# EAGLE design CANBridge (EAGLE 9.6.2)
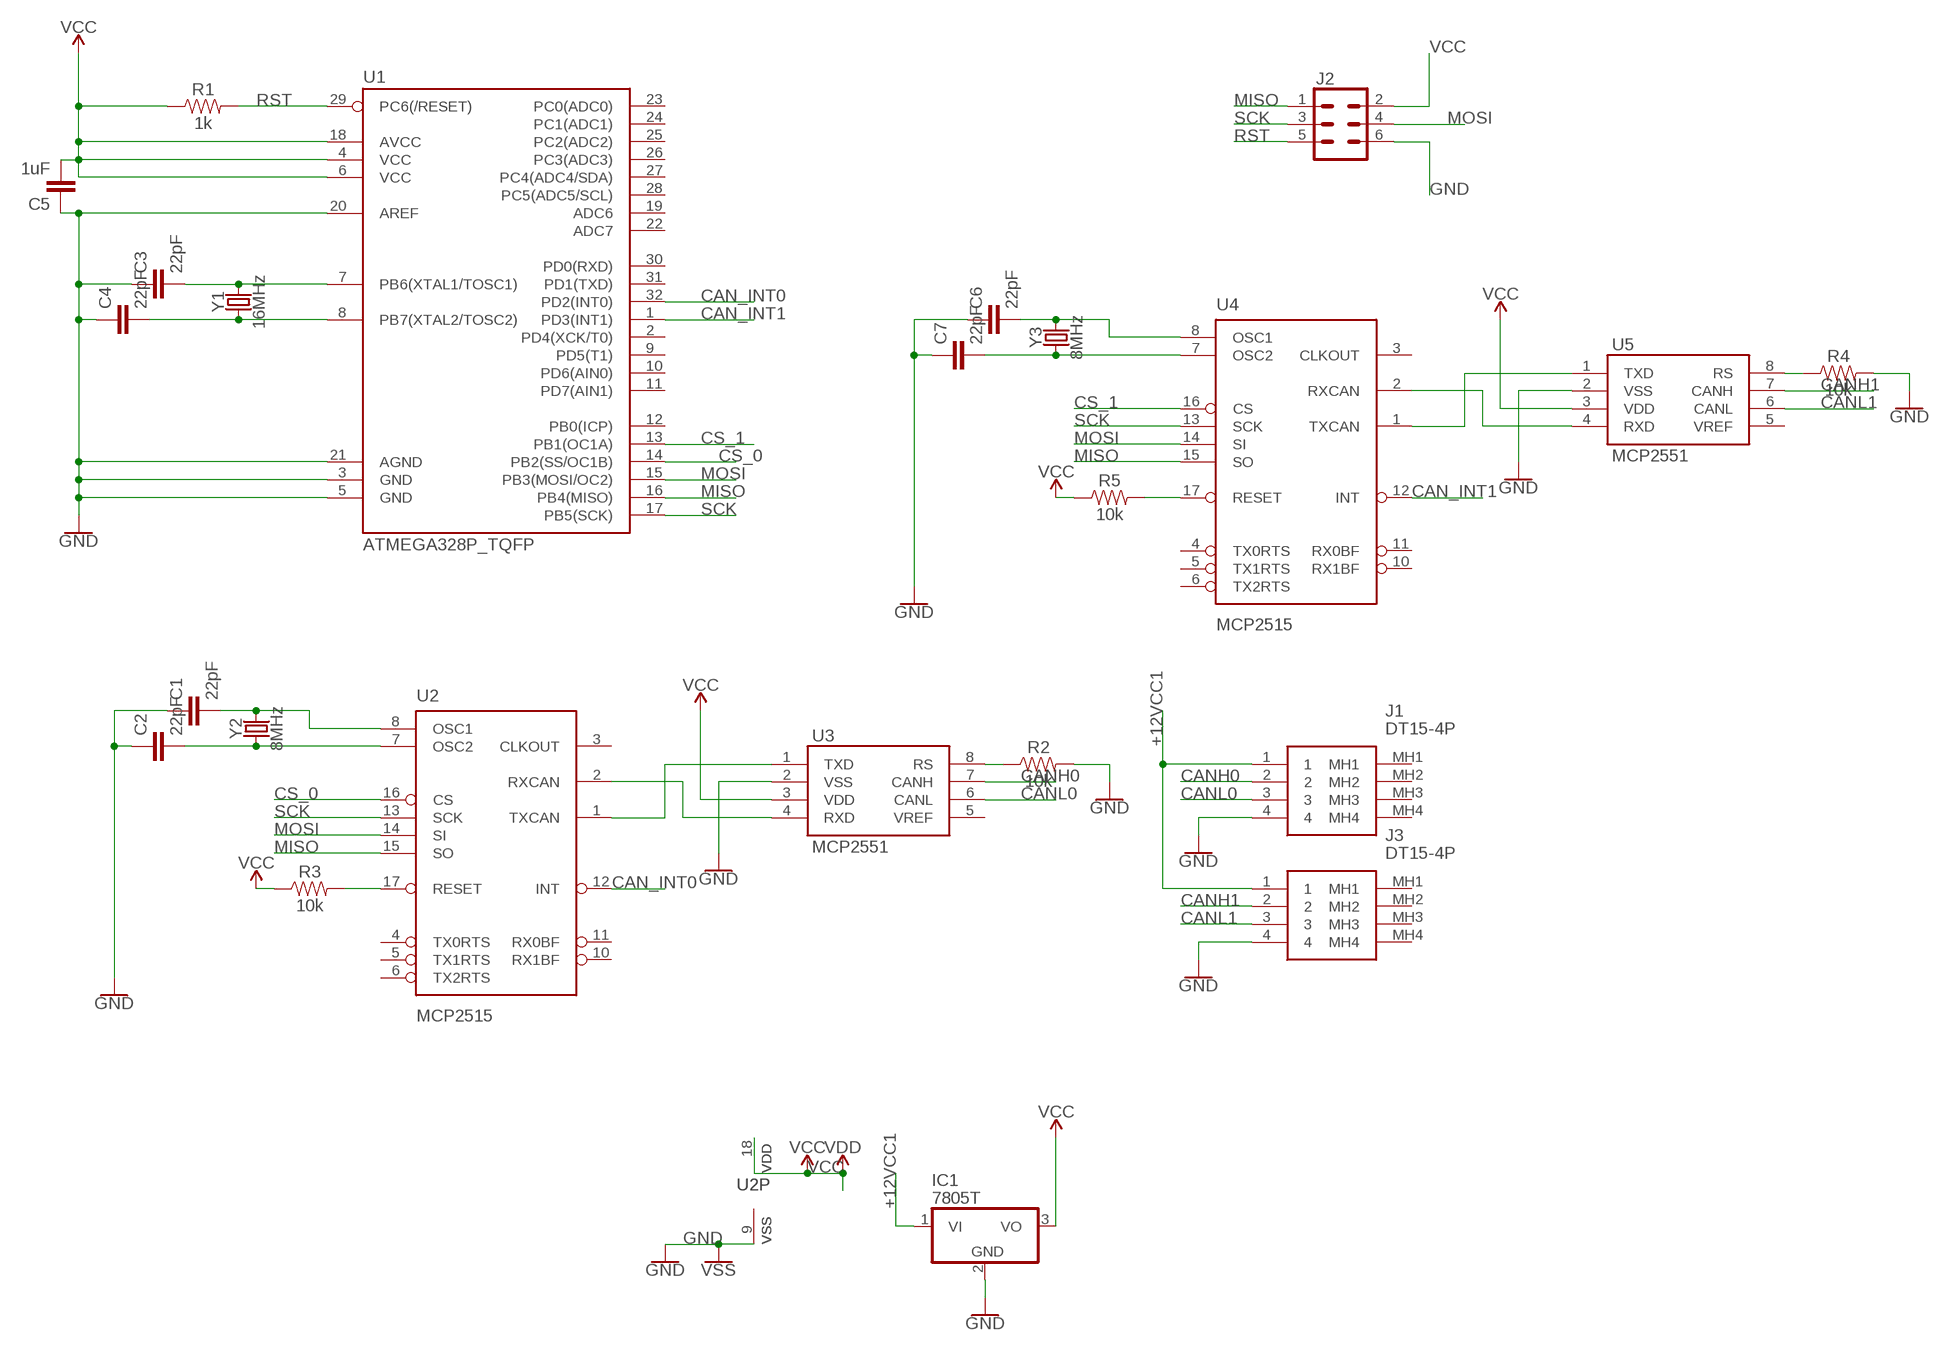
[diagram p0: schematic, sheet 1]

## Parts
C1  22pF  22PF-0603-50V-5%  [0603]
C2  22pF  22PF-0603-50V-5%  [0603]
C3  22pF  22PF-0603-50V-5%  [0603]
C4  22pF  22PF-0603-50V-5%  [0603]
C5  1uF  22PF-0603-50V-5%  [0603]
C6  22pF  22PF-0603-50V-5%  [0603]
C7  22pF  22PF-0603-50V-5%  [0603]
IC1  7805T  [TO220H]
J1  DT15-4P  [DT154P]
J2  CONN_03X2SHROUD  [2X3-SHROUDED]
J3  DT15-4P  [DT154P]
R1  1k  1KOHM-0603-1/10W-1%  [0603]
R2  10k  1KOHM-0603-1/10W-1%  [0603]
R3  10k  1KOHM-0603-1/10W-1%  [0603]
R4  10k  1KOHM-0603-1/10W-1%  [0603]
R5  10k  1KOHM-0603-1/10W-1%  [0603]
U1  ATMEGA328P_TQFP  [TQFP32-08]
U2  MCP2515  MCP2515(MCP2510)SO  [SO18W]
U3  MCP2551  [SO08]
U4  MCP2515  MCP2515(MCP2510)SO  [SO18W]
U5  MCP2551  [SO08]
Y1  16MHz  CRYSTAL-8MHZSMD-HC49UP  [HC49UP]
Y2  8MHz  CRYSTAL-8MHZSMD-HC49UP  [HC49UP]
Y3  8MHz  CRYSTAL-8MHZSMD-HC49UP  [HC49UP]

## Nets
+12VCC1: IC1.1(VI) J1.1 J3.1
CAN_INT0: U1.32(PD2(INT0)) U2.12(INT)
CAN_INT1: U1.1(PD3(INT1)) U4.12(INT)
CANH0: J1.2 U3.7(CANH)
CANH1: J3.2 U5.7(CANH)
CANL0: J1.3 U3.6(CANL)
CANL1: J3.3 U5.6(CANL)
CS_0: U1.14(PB2(SS/OC1B)) U2.16(CS)
CS_1: U1.13(PB1(OC1A)) U4.16(CS)
GND: C1.1 C2.1 C3.1 C4.1 C5.1 C6.1 C7.1 IC1.2(GND) J1.4 J2.6 J3.4 R2.2 R4.2 U1.3(GND) U1.5(GND) U1.20(AREF) U1.21(AGND) U2.9(VSS) U3.2(VSS) U5.2(VSS) ; supply symbol labelled VSS
MISO: J2.1 U1.16(PB4(MISO)) U2.15(SO) U4.15(SO)
MOSI: J2.4 U1.15(PB3(MOSI/OC2)) U2.14(SI) U4.14(SI)
N$1: U2.1(TXCAN) U3.1(TXD)
N$2: U2.2(RXCAN) U3.4(RXD)
N$3: C2.2 U2.7(OSC2) Y2.1
N$4: C1.2 U2.8(OSC1) Y2.2
N$5: C4.2 U1.8(PB7(XTAL2/TOSC2)) Y1.1
N$6: C3.2 U1.7(PB6(XTAL1/TOSC1)) Y1.2
N$7: R2.1 U3.8(RS)
N$8: R3.2 U2.17(RESET)
N$9: U4.1(TXCAN) U5.1(TXD)
N$10: U4.2(RXCAN) U5.4(RXD)
N$11: C7.2 U4.7(OSC2) Y3.1
N$12: C6.2 U4.8(OSC1) Y3.2
N$13: R4.1 U5.8(RS)
N$14: R5.2 U4.17(RESET)
RST: J2.5 R1.2 U1.29(PC6(/RESET))
SCK: J2.3 U1.17(PB5(SCK)) U2.13(SCK) U4.13(SCK)
VCC: C5.2 IC1.3(VO) J2.2 R1.1 R3.1 R5.1 U1.4(VCC) U1.6(VCC) U1.18(AVCC) U2.18(VDD) U3.3(VDD) U5.3(VDD) ; supply symbol labelled VDD
Unconnected: J1.MH1 J1.MH2 J1.MH3 J1.MH4 J3.MH1 J3.MH2 J3.MH3 J3.MH4 U1.2(PD4(XCK/T0)) U1.9(PD5(T1)) U1.10(PD6(AIN0)) U1.11(PD7(AIN1)) U1.12(PB0(ICP)) U1.19(ADC6) U1.22(ADC7) U1.23(PC0(ADC0)) U1.24(PC1(ADC1)) U1.25(PC2(ADC2)) U1.26(PC3(ADC3)) U1.27(PC4(ADC4/SDA)) U1.28(PC5(ADC5/SCL)) U1.30(PD0(RXD)) U1.31(PD1(TXD)) U2.3(CLKOUT) U2.4(TX0RTS) U2.5(TX1RTS) U2.6(TX2RTS) U2.10(RX1BF) U2.11(RX0BF) U3.5(VREF) U4.3(CLKOUT) U4.4(TX0RTS) U4.5(TX1RTS) U4.6(TX2RTS) U4.10(RX1BF) U4.11(RX0BF) U5.5(VREF)

## Power pins joined to a net without a drawn wire
VDD: U4.18(VDD)
VSS: U4.9(VSS)

## Library data of the parts
C1-C4 C6 C7 = SparkFun-Capacitors:22PF: 22pF ceramic capacitors A capacitor is a passive two-terminal electrical component used to store electrical energy temporarily in an electric field.; PROD_ID: CAP-07876
C5 = SparkFun-Capacitors:22PF: 22pF ceramic capacitors A capacitor is a passive two-terminal electrical component used to store electrical energy temporarily in an electric field.; PROD_ID: CAP-07876; VALUE: 22pF
IC1 = linear:78*: Positive VOLTAGE REGULATOR Source: http://cache.national.com/ds/LM/LM78L05.pdf http://www.fairchildsemi.com/ds/LM/LM7805.pdf
J1 J3 = DT15-4P:DT15-4P: Deutsch DT15 Series, 4.44mm Pitch 4 Way 2 Row Straight PCB Header, Solder Termination Source: Datasheet <https://www.te.com/commerce/DocumentDelivery/DDEController?Action=showdoc&DocId=Customer DrawingDT15-4PD2pdfEnglishENG_CD_DT15-4P_D2.pdfDT15-4P>; DESCRIPTION: Deutsch DT15 Series, 4.44mm Pitch 4 Way 2 Row Straight PCB Header, Solder Termination; HEIGHT: 30.35mm; MANUFACTURER_NAME: TE Connectivity; MANUFACTURER_PART_NUMBER: DT15-4P; MOUSER_PART_NUMBER: 571-DT15-4P; MOUSER_PRICE-STOCK: https://www.mouser.co.uk/ProductDetail/TE-Connectivity-DEUTSCH/DT15-4P?qs=vkMqrgFpRajtjo1r4fVe%2Fw%3D%3D
J2 = SparkFun-Connectors:CONN_03X2: Multi connection point. Often used as Generic Header-pin footprint for 0.1 inch spaced/style header connections You can populate with any combo of single row headers, but if you'd like an exact match, check these: Header - 2x3 (Male, 0.1") <https://www.sparkfun.com/products/12807> (PRT-12807) Header - 2x3 (Female, 0.1") <https://www.sparkfun.com/products/13010> (PRT-13010) 2x3 Pin Shrouded Header <https://www.sparkfun.com/products/10877> (PRT-10877) On any of the 0.1 inch spaced packages, you can populate with these: Break Away Headers - Straight <https://www.sparkfun.com/products/116> (PRT-00116) Break Away Male Headers - Right Angle <https://www.sparkfun.com/products/553> (PRT-00553) Female Headers <https://www.sparkfun.com/products/115> (PRT-00115) Break Away Headers - Machine Pin <https://www.sparkfun.com/products/117> (PRT-00117) Break Away Female Headers - Swiss Machine Pin <https://www.sparkfun.com/products/743> (PRT-00743) Special note: the shrouded connector mates well with our 3x2 ribbon cables: Ribbon Crimp Connector - 6-pin (2x3, Female) <https://www.sparkfun.com/products/10651> (PRT-10651) Ribbon Cable - 6 wire (15ft) <https://www.sparkfun.com/products/10646> (PRT-10646); PROD_ID: CONN-10681; SF_ID: PRT_10877
R1 = SparkFun-Resistors:1KOHM: 1kΩ resistor A resistor is a passive two-terminal electrical component that implements electrical resistance as a circuit element. Resistors act to reduce current flow, and, at the same time, act to lower voltage levels within circuits. - Wikipedia; PROD_ID: RES-07856
R2-R5 = SparkFun-Resistors:1KOHM: 1kΩ resistor A resistor is a passive two-terminal electrical component that implements electrical resistance as a circuit element. Resistors act to reduce current flow, and, at the same time, act to lower voltage levels within circuits. - Wikipedia; PROD_ID: RES-07856; VALUE: 1k
U1 = SparkFun-IC-Microcontroller:ATMEGA328P_TQFP: Popular 328P in QFP Storefront component: ATmega328 - TQFP <https://www.sparkfun.com/products/13448> (COM-13448) Datasheet <http://www.sparkfun.com/datasheets/Components/SMD/ATMega328.pdf> SparkFun Products SparkFun RedBoard - Programmed with Arduino <https://www.sparkfun.com/products/12757> (DEV-12757) Arduino Pro Mini 328 - 5V/16MHz <https://www.sparkfun.com/products/11113> (DEV-11113) Arduino Pro Mini 328 - 3.3V/8MHz <https://www.sparkfun.com/products/11114> (DEV-11114) SparkFun OpenLog <https://www.sparkfun.com/products/13712> (DEV-13712) SparkFun MicroView - OLED Arduino Module <https://www.sparkfun.com/products/12923> (DEV-12923) SparkFun Digital Sandbox <https://www.sparkfun.com/products/12651> (DEV-12651) SparkFun PicoBoard <https://www.sparkfun.com/products/11888> (WIG-11888) Arduino Fio <https://www.sparkfun.com/products/10116> (DEV-10116) LilyPad Arduino 328 Main Board <https://www.sparkfun.com/products/13342> (DEV-13342) SparkFun RedStick <https://www.sparkfun.com/products/13741> (DEV-13741) LilyPad MP3 <https://www.sparkfun.com/products/11013> (DEV-11013) LilyPad Arduino SimpleSnap <https://www.sparkfun.com/products/10941> (DEV-10941) SparkFun Stepoko <https://www.sparkfun.com/products/13899> (ROB-13899) SparkFun Geiger Counter <https://www.sparkfun.com/products/11345> (SEN-11345) SparkFun EL Sequencer <https://www.sparkfun.com/products/12781> (COM-12781) Arduino Pro 328 - 5V/16MHz <https://www.sparkfun.com/products/10915> (DEV-10915) CryptoCape <https://www.sparkfun.com/products/12773> (DEV-12773) SparkFun IR Thermometer Evaluation Board - MLX90614 <https://www.sparkfun.com/products/10740> (SEN-10740) SparkFun RedBot Mainboard <https://www.sparkfun.com/products/12097> (ROB-12097) Arduino Pro 328 - 3.3V/8MHz <https://www.sparkfun.com/products/10914> (DEV-10914) SparkFun Block for Intel® Edison - Arduino <https://www.sparkfun.com/products/13036> (DEV-13036) SparkFun Simon Says - Surface Mount Soldering Kit <https://www.sparkfun.com/products/10935> (KIT-10935) SparkFun 7-Segment Serial Display - Red <https://www.sparkfun.com/products/11441> (COM-11441) SparkFun 7-Segment Serial Display - White <https://www.sparkfun.com/products/11629> (COM-11629) SparkFun 7-Segment Serial Display - Yellow <https://www.sparkfun.com/products/11443> (COM-11443) SparkFun 7-Segment Serial Display - Kelly Green <https://www.sparkfun.com/products/11440> (COM-11440) SparkFun 7-Segment Serial Display - Blue <https://www.sparkfun.com/products/11442> (COM-11442) SparkFun OpenSegment Serial Display - 20mm (Blue) <https://www.sparkfun.com/products/11647> (COM-11647) SparkFun OpenSegment Serial Display - 20mm (Green) <https://www.sparkfun.com/products/11646> (COM-11646) SparkFun OpenSegment Serial Display - 20mm (White) <https://www.sparkfun.com/products/11648> (COM-11648) SparkFun OpenSegment Serial Display - 20mm (Red) <https://www.sparkfun.com/products/11644> (COM-11644) SparkFun OpenSegment Serial Display - 20mm (Yellow) <https://www.sparkfun.com/products/11645> (COM-11645) SparkFun OpenSegment Shield <https://www.sparkfun.com/products/13190> (DEV-13190); PROD_ID: IC-09069
U2 U4 = SparkFun-IC-Comms:MCP2515(MCP2510): CAN controller with SPI interface The MCP2515 controller supercedes the MCP2510 while addressing all errata associated with it. The two devices are pin compatible, either can be used with this device. 18-pin package SOIC Simple SPI interface to any MCU. One-shot mode ensures message transmission is attempted only once Databyte filtering Start-of-Frame (SOF) output Low-power CMOS Technology Datasheet <http://www.sparkfun.com/datasheets/DevTools/Arduino/MCP2515.pdf> SparkFun Products CAN-BUS Shield <https://www.sparkfun.com/products/13262> (DEV-13262); PROD_ID: IC-09906
U3 U5 = SparkFun-IC-Comms:MCP2551: MCP2551 High Speed CAN Transceiver High speed CAN transceiver Datasheet <http://www.sparkfun.com/datasheets/DevTools/Arduino/MCP2551.pdf> SparkFun Products CAN-BUS Shield <https://www.sparkfun.com/products/13262> (DEV-13262) SparkFun OBD-II UART <https://www.sparkfun.com/products/9555> (WIG-09555); PROD_ID: IC-09907
Y1 = SparkFun-Clocks:CRYSTAL-8MHZ: 8MHz Crystal Datasheet Example <http://www.futureelectronics.com/en/technologies/electromechanical/timing-devices/crystals/Pages/6008189-ABM3B-8.000MHZ-B2-T.aspx?IM=0> Frequency: 8MHz Frequency Tolerance: ±20ppm Load Capacitance: 18pF SparkFun Products: Pro Micro -3.3V/8MHz <https://www.sparkfun.com/products/12587> WAV Trigger <https://www.sparkfun.com/products/13660>; PROD_ID: XTAL-11706; VALUE: 8MHz
Y2 Y3 = SparkFun-Clocks:CRYSTAL-8MHZ: 8MHz Crystal Datasheet Example <http://www.futureelectronics.com/en/technologies/electromechanical/timing-devices/crystals/Pages/6008189-ABM3B-8.000MHZ-B2-T.aspx?IM=0> Frequency: 8MHz Frequency Tolerance: ±20ppm Load Capacitance: 18pF SparkFun Products: Pro Micro -3.3V/8MHz <https://www.sparkfun.com/products/12587> WAV Trigger <https://www.sparkfun.com/products/13660>; PROD_ID: XTAL-11706

## Net classes
0 default: width 0.305 mm

## Board
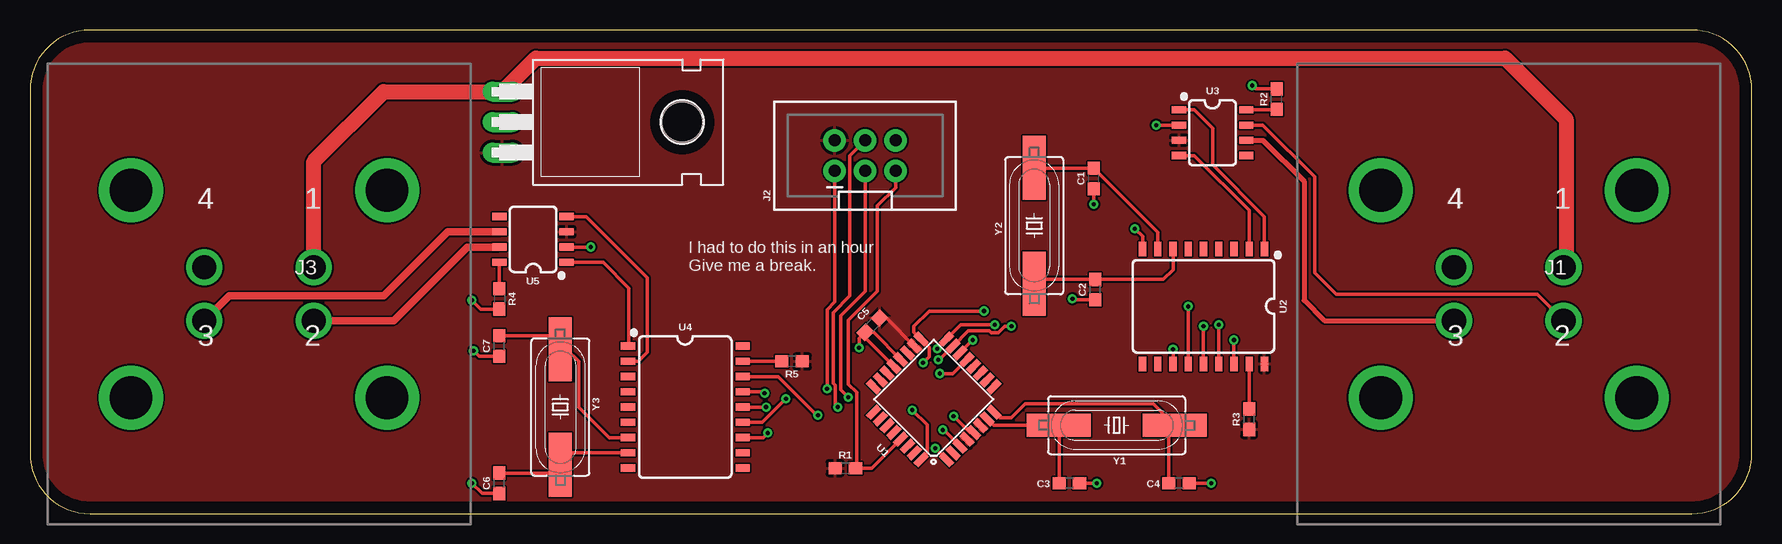
[diagram p1: board, top side]
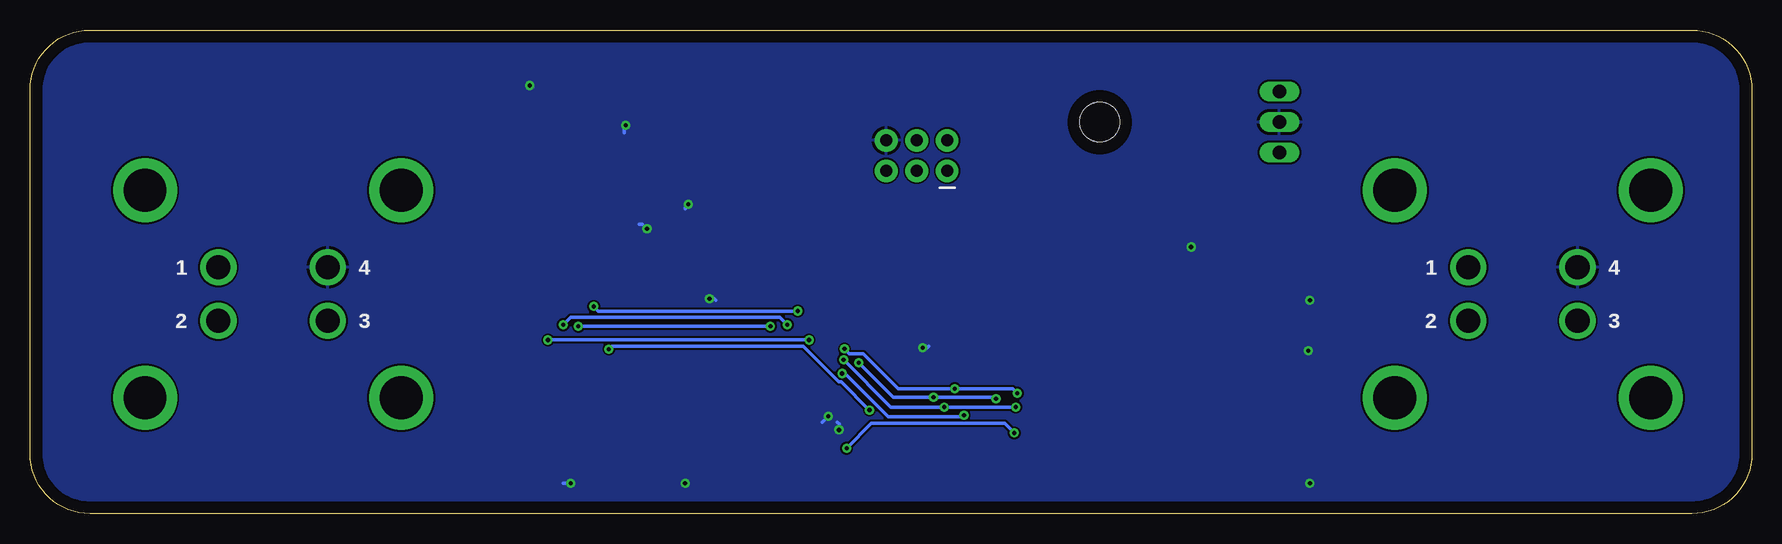
[diagram p2: board, bottom side, seen from below]

Size 143.49 x 40.31 mm. Coordinates in mm from the lower left corner, seen from the top.
Outline: 0,35.31 0,5 arc90 5,0 138.49,0 arc90 143.49,5 143.49,35.31 arc90 138.49,40.31 5,40.31 arc90 0,35.31
Copper layers (1*16): Top 0.035mm / dielectric 1.5mm / Bottom 0.035mm
Design rules "default": minimum track width 6mil, minimum drill 0.35mm, track to track 6mil, track to pad 6mil, pad to pad 6mil, via to via 6mil, smd to smd 6mil, copper to edge 40mil, drill to drill 6mil, minimum pad ring 10mil, minimum via ring 8mil, stop-mask expansion 4mil, vias tented up to drill 0mil, thermal gap 10mil

### Footprints (pad centres in the part's own frame; a part is rotated, then mirrored left to right if it is on the bottom)
0603 = smd 1.1 x 1: 1 -0.85,0; 2 0.85,0
TO220H = drill 1.118 long: 1 -2.54,-10.16; 2 0,-10.16; 3 2.54,-10.16 | hole 3.302: 0,4.826
DT154P = drill 2.01 pad 3.015: 1 4.599,2.215; 2 4.599,-2.235; 3 -4.521,-2.235; 4 -4.521,2.215 | drill 3.56 pad 5.34: MH1 -10.631,-8.66; MH2 -10.631,8.64; MH3 10.709,8.64; MH4 10.709,-8.66
2X3-SHROUDED = drill 1.016 pad 1.88: 1 -1.27,2.54; 2 1.27,2.54; 3 -1.27,0; 4 1.27,0; 5 -1.27,-2.54; 6 1.27,-2.54
TQFP32-08 = smd 1.27 x 0.559: 1 -4.293,2.8; 2 -4.293,2; 3 -4.293,1.2; 4 -4.293,0.4; 5 -4.293,-0.4; 6 -4.293,-1.2; 7 -4.293,-2; 8 -4.293,-2.8; 17 4.293,-2.8; 18 4.293,-2; 19 4.293,-1.2; 20 4.293,-0.4; 21 4.293,0.4; 22 4.293,1.2; 23 4.293,2; 24 4.293,2.8 | smd 0.559 x 1.27: 9 -2.8,-4.293; 10 -2,-4.293; 11 -1.2,-4.293; 12 -0.4,-4.293; 13 0.4,-4.293; 14 1.2,-4.293; 15 2,-4.293; 16 2.8,-4.293; 25 2.8,4.293; 26 2,4.293; 27 1.2,4.293; 28 0.4,4.293; 29 -0.4,4.293; 30 -1.2,4.293; 31 -2,4.293; 32 -2.8,4.293
SO18W = smd 0.6 x 1.2: 1 -5.08,-4.788; 2 -3.81,-4.788; 3 -2.54,-4.788; 4 -1.27,-4.788; 5 0,-4.788; 6 1.27,-4.788; 7 2.54,-4.788; 8 3.81,-4.788; 9 5.08,-4.788; 10 5.08,4.788; 11 3.81,4.788; 12 2.54,4.788; 13 1.27,4.788; 14 0,4.788; 15 -1.27,4.788; 16 -2.54,4.788; 17 -3.81,4.788; 18 -5.08,4.788
SO08 = smd 0.6 x 1.2: 1 -1.905,-2.8; 2 -0.635,-2.8; 3 0.635,-2.8; 4 1.905,-2.8; 5 1.905,2.8; 6 0.635,2.8; 7 -0.635,2.8; 8 -1.905,2.8
HC49UP = smd 5.334 x 1.93: 1 -4.826,0; 2 4.826,0

### Placement (x,y rotation side)
C1  88.65,27.94 90 top
C2  88.77,18.67 90 top
C3  86.61,2.54 180 top
C4  95.76,2.54 180 top
C5  70.19,15.71 45 top
C6  39.12,2.54 90 top
C7  39.12,13.97 90 top
IC1  49.53,32.64 270 top
J1  123.19,18.32 0 top
J2  69.6,29.84 90 top
J3  19.05,18.32 0 top
R1  67.94,3.81 0 top
R2  103.89,34.54 90 top
R3  101.6,7.87 90 top
R4  39.12,17.91 270 top
R5  63.5,12.7 180 top
U1  75.31,9.53 135 top
U2  97.79,17.27 180 top
U3  98.55,31.75 270 top
U4  54.61,8.89 270 top
U5  41.91,22.86 90 top
Y1  90.55,7.37 180 top
Y2  83.69,24 90 top
Y3  44.2,8.89 270 top

### Tracks (layer width: path | path; a pad name or v marks a point on that pad's centre or on a via)
+12VCC1
  Top 1.27: J3.1 23.65,29.36 29.46,35.18 IC1.1 42.16,37.97 122.94,37.97 128.02,32.89 128.02,20.07 127.79,20.29 J1.1
CAN_INT0  (via drill 0.35)
  Top 0.305: U1.32 74.75,5.01 74.75,7.41 v73.53,8.64 | v95.25,13.72 U2.12
  Bottom 0.305: v73.53,8.64 75.9,11 76.1,11 79.07,13.97 95,13.97 v95.25,13.72
CAN_INT1  (via drill 0.35)
  Top 0.305: U1.1 75.44,5.44 v75.44,5.46 | v61.47,6.73 61.09,6.35 U4.12
  Bottom 0.305: v75.44,5.46 73.38,7.52 62.26,7.52 v61.47,6.73
CANH0
  Top 0.305: U3.7 102.74,32.38 107.06,28.07 107.06,20.07 108.84,18.29 125.59,18.29 J1.2
CANH1
  Top 0.61: J3.2 30.31,16.09 36.45,22.22 U5.7
CANL0
  Top 0.406: U3.6 102.74,31.11 106.17,27.69 106.17,17.78 107.87,16.09 J1.3
CANL1
  Top 0.61: J3.3 16.61,18.16 29.46,18.16 34.8,23.5 U5.6
CS_0  (via drill 0.35)
  Top 0.305: 100.33,13.84 U2.16 v100.33,14.48 | U1.14 v78.57,14.48
  Bottom 0.305: v78.57,14.48 v100.33,14.48
CS_1  (via drill 0.35)
  Top 0.305: U4.16 62.36,11.43 65.58,8.21 v65.66,8.21 | v75.82,11.68 76.9,11.68 U1.13
  Bottom 0.305: v65.66,8.21 65.79,8.08 71.96,8.08 75.56,11.68 v75.82,11.68
GND  (via drill 0.35)
  Top 0.305: U1.21 69.59,14.68 C5.1 | U1.20 70.29,15.11 C5.1 | C5.1 69.09,14.61 v69.09,13.84 | U1.3 76.15,6.98 v76.07,6.98 | U1.5 78.32,6.77 77.94,7.16 77.93,7.16 v76.96,8.13 | C3.1 v88.9,2.54 | C4.1 v98.42,2.54 | U2.9 92.71,23.11 v92.07,23.75 | U3.2 v93.85,32.38 | R2.2 102.15,35.39 v101.85,35.69 | C1.1 v88.65,25.78 | C2.1 86.96,17.82 v86.87,17.91 | C6.1 37.68,1.69 v36.83,2.54 | C7.1 37.43,13.12 v36.96,13.59 | R4.2 37.55,17.06 v36.83,17.78 | U5.2 v46.74,22.22
  Bottom 0.305: v69.09,13.84 68.71,13.84 68.58,13.97 | v76.07,6.98 76.07,7.49 76.2,7.62 | v76.96,8.13 77.47,7.62 | v98.42,2.54 99.06,2.54 | v92.07,23.75 92.46,24.13 92.71,24.13 | v93.85,32.38 93.98,32.26 93.98,31.75 | v101.85,35.69 101.73,35.69 101.6,35.56 | v88.65,25.78 88.9,25.53 88.9,25.4 | v86.87,17.91 86.49,17.91 86.36,17.78 | v36.83,17.78 36.96,17.65 36.96,17.53 | v46.74,22.22 46.61,22.22
  pour Bottom: 0,43.18 0,0 143.51,0 143.51,43.18
MISO  (via drill 0.35)
  Top 0.305: v75.61,13.74 75.61,13.79 U1.16 77.57,15.75 v80.39,15.75 | v61.21,10.03 61.09,10.16 U4.15 | v99.06,15.75 U2.15 | J2.1 67.06,17.65 66.42,17.02 v66.42,10.41
  Bottom 0.305: v75.61,13.74 75.21,13.33 74.04,13.33 71.12,10.41 v66.42,10.41 61.59,10.41 v61.21,10.03 | v80.39,15.75 81.03,16.38 98.42,16.38 v99.06,15.75
MOSI  (via drill 0.35)
  Top 0.305: v75.69,12.83 75.78,12.83 U1.15 78.2,15.24 79.93,15.24 80.11,15.06 80.67,15.06 81.23,15.62 v81.79,15.62 | v61.34,8.89 U4.14 | U2.14 v97.79,15.62 | J2.4 68.33,29.84 68.33,18.16 66.93,16.76 66.93,10.87 67.1,10.7 67.1,9.1 v67.31,8.89
  Bottom 0.305: v75.69,12.83 71.75,8.89 v67.31,8.89 v61.34,8.89 | v97.79,15.62 v81.79,15.62
N$1
  Top 0.305: U3.1 97.03,33.66 98.55,32.13 98.55,29.08 102.87,24.77 U2.1
N$2
  Top 0.305: U3.4 97.03,29.84 101.6,25.27 U2.2
N$3
  Top 0.305: Y2.1 84.03,19.52 C2.2 94.45,19.52 95.25,20.32 U2.7
N$4
  Top 0.305: Y2.2 83.73,28.79 C1.2 93.98,23.46 U2.8
N$5
  Top 0.305: U1.8 80.79,8 81.79,8 82.93,9.14 93.6,9.14 95.06,7.68 | 95.06,7.68 Y1.1 | C4.2 94.91,7.53 95.06,7.68
N$6
  Top 0.305: U1.7 80.3,7.37 Y1.2 85.76,7.33 C3.2
N$7
  Top 0.305: U3.8 103.85,33.66 R2.1
N$8
  Top 0.305: R3.2 U2.17
N$9
  Top 0.305: U5.1 47.75,20.95 49.91,18.8 49.91,14.06 U4.1
N$10
  Top 0.305: U4.2 50.67,12.7 51.44,13.46 51.44,19.68 46.36,24.77 U5.4
N$11
  Top 0.305: C7.2 43.09,14.82 Y3.1 44.7,13.72 45.72,12.7 45.72,8.89 48.26,6.35 U4.7
N$12
  Top 0.305: C6.2 43.52,3.39 Y3.2 45.21,5.08 U4.8
N$13
  Top 0.305: R4.1 U5.8
N$14
  Top 0.305: U4.17 R5.2
RST
  Top 0.305: U1.29 70.16,3.81 R1.2 68.88,3.9 68.88,10.11 68.2,10.79 68.2,16.13 70.61,18.54 70.61,25.65 72.14,27.18 J2.5
SCK  (via drill 0.35)
  Top 0.305: U4.13 61.04,7.62 v62.99,9.57 | v74.42,12.57 74.93,13.08 74.93,13.87 U1.17 73.66,15.14 73.66,15.62 74.93,16.89 v79.5,16.89 | v96.52,17.27 U2.13 | J2.3 69.6,18.54 67.56,16.51 67.56,10.33 v68.2,9.7
  Bottom 0.305: v62.99,9.57 63.12,9.7 v68.2,9.7 71.55,9.7 v74.42,12.57 | v79.5,16.89 96.14,16.89 v96.52,17.27
VCC
  Top 0.305: U1.18 71.35,16.31 C5.2
  pour Top: 0,40.64 0,0 143.51,0 143.51,40.64

### Text on the board
tPlace: 4 | 1 | 4 | 1 | I had to do this in an hour / Give me a break. | 3 | 2 | 3 | 2